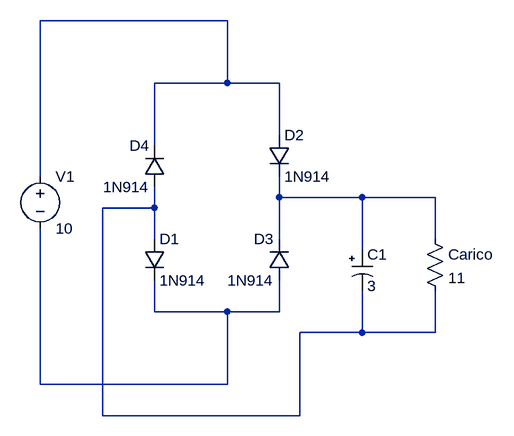
[diagram p0: schematic formatted_circuit.asc]
formatted_circuit.asc, the LTspice schematic file:
Version 4
SHEET 1 880 680
WIRE -32 -304 -320 -304
WIRE -32 -208 -32 -304
WIRE -32 -208 -144 -208
WIRE 48 -208 -32 -208
WIRE 48 -128 48 -208
WIRE -144 -112 -144 -208
WIRE -320 -64 -320 -304
WIRE 48 -32 48 -64
WIRE 176 -32 48 -32
WIRE 288 -32 176 -32
WIRE -144 -16 -144 -48
WIRE -144 -16 -224 -16
WIRE -144 32 -144 -16
WIRE 48 32 48 -32
WIRE 288 32 288 -32
WIRE 176 48 176 -32
WIRE -144 144 -144 96
WIRE -32 144 -144 144
WIRE 48 144 48 96
WIRE 48 144 -32 144
WIRE 176 176 176 112
WIRE 176 176 80 176
WIRE 288 176 288 112
WIRE 288 176 176 176
WIRE -320 256 -320 16
WIRE -32 256 -32 144
WIRE -32 256 -320 256
WIRE -224 304 -224 -16
WIRE 80 304 80 176
WIRE 80 304 -224 304
SYMBOL diode -160 32 R0
SYMATTR InstName D1
SYMATTR Value 1N914
SYMBOL diode 32 -128 R0
SYMATTR InstName D2
SYMATTR Value 1N914
SYMBOL diode 64 96 R180
WINDOW 0 24 64 Left 2
WINDOW 3 24 0 Left 2
SYMATTR InstName D3
SYMATTR Value 1N914
SYMBOL diode -128 -48 R180
WINDOW 0 24 64 Left 2
WINDOW 3 24 0 Left 2
SYMATTR InstName D4
SYMATTR Value 1N914
SYMBOL voltage -320 -80 R0
WINDOW 123 0 0 Left 0
WINDOW 39 24 44 Left 2
SYMATTR InstName V1
SYMATTR Value 10
SYMBOL res 272 16 R0
SYMATTR InstName Carico
SYMATTR Value 11
SYMATTR SpiceLine tol=1 pwr=0.1
SYMBOL polcap 160 48 R0
WINDOW 3 24 56 Left 2
SYMATTR Value 3
SYMATTR InstName C1
SYMATTR Description Capacitor
SYMATTR Type cap
SYMATTR SpiceLine V=2.7 Irms=0 Rser=0.0453121 Lser=25n mfg="Würth Elektronik" pn="850617030001 WCAP-STSC 8x20" type="Super Capacitor"

The netlist it stands for:
* formatted_circuit.asc
D1 N003 N004 1N914
D2 N001 N002 1N914
D3 N004 N002 1N914
D4 N003 N001 1N914
V1 N001 N004 10
R§Carico N002 N003 11 tol=1 pwr=0.1
C1 N002 N003 3 V=2.7 Irms=0 Rser=0.0453121 Lser=25n mfg="Würth Elektronik" pn="850617030001 WCAP-STSC 8x20" type="Super Capacitor"
.model D D
.lib standard.dio
.backanno
.end